# Altium schematic sheet 5V_REG.SchDoc
size B; SheetNumber: 5; SheetTotal: 17
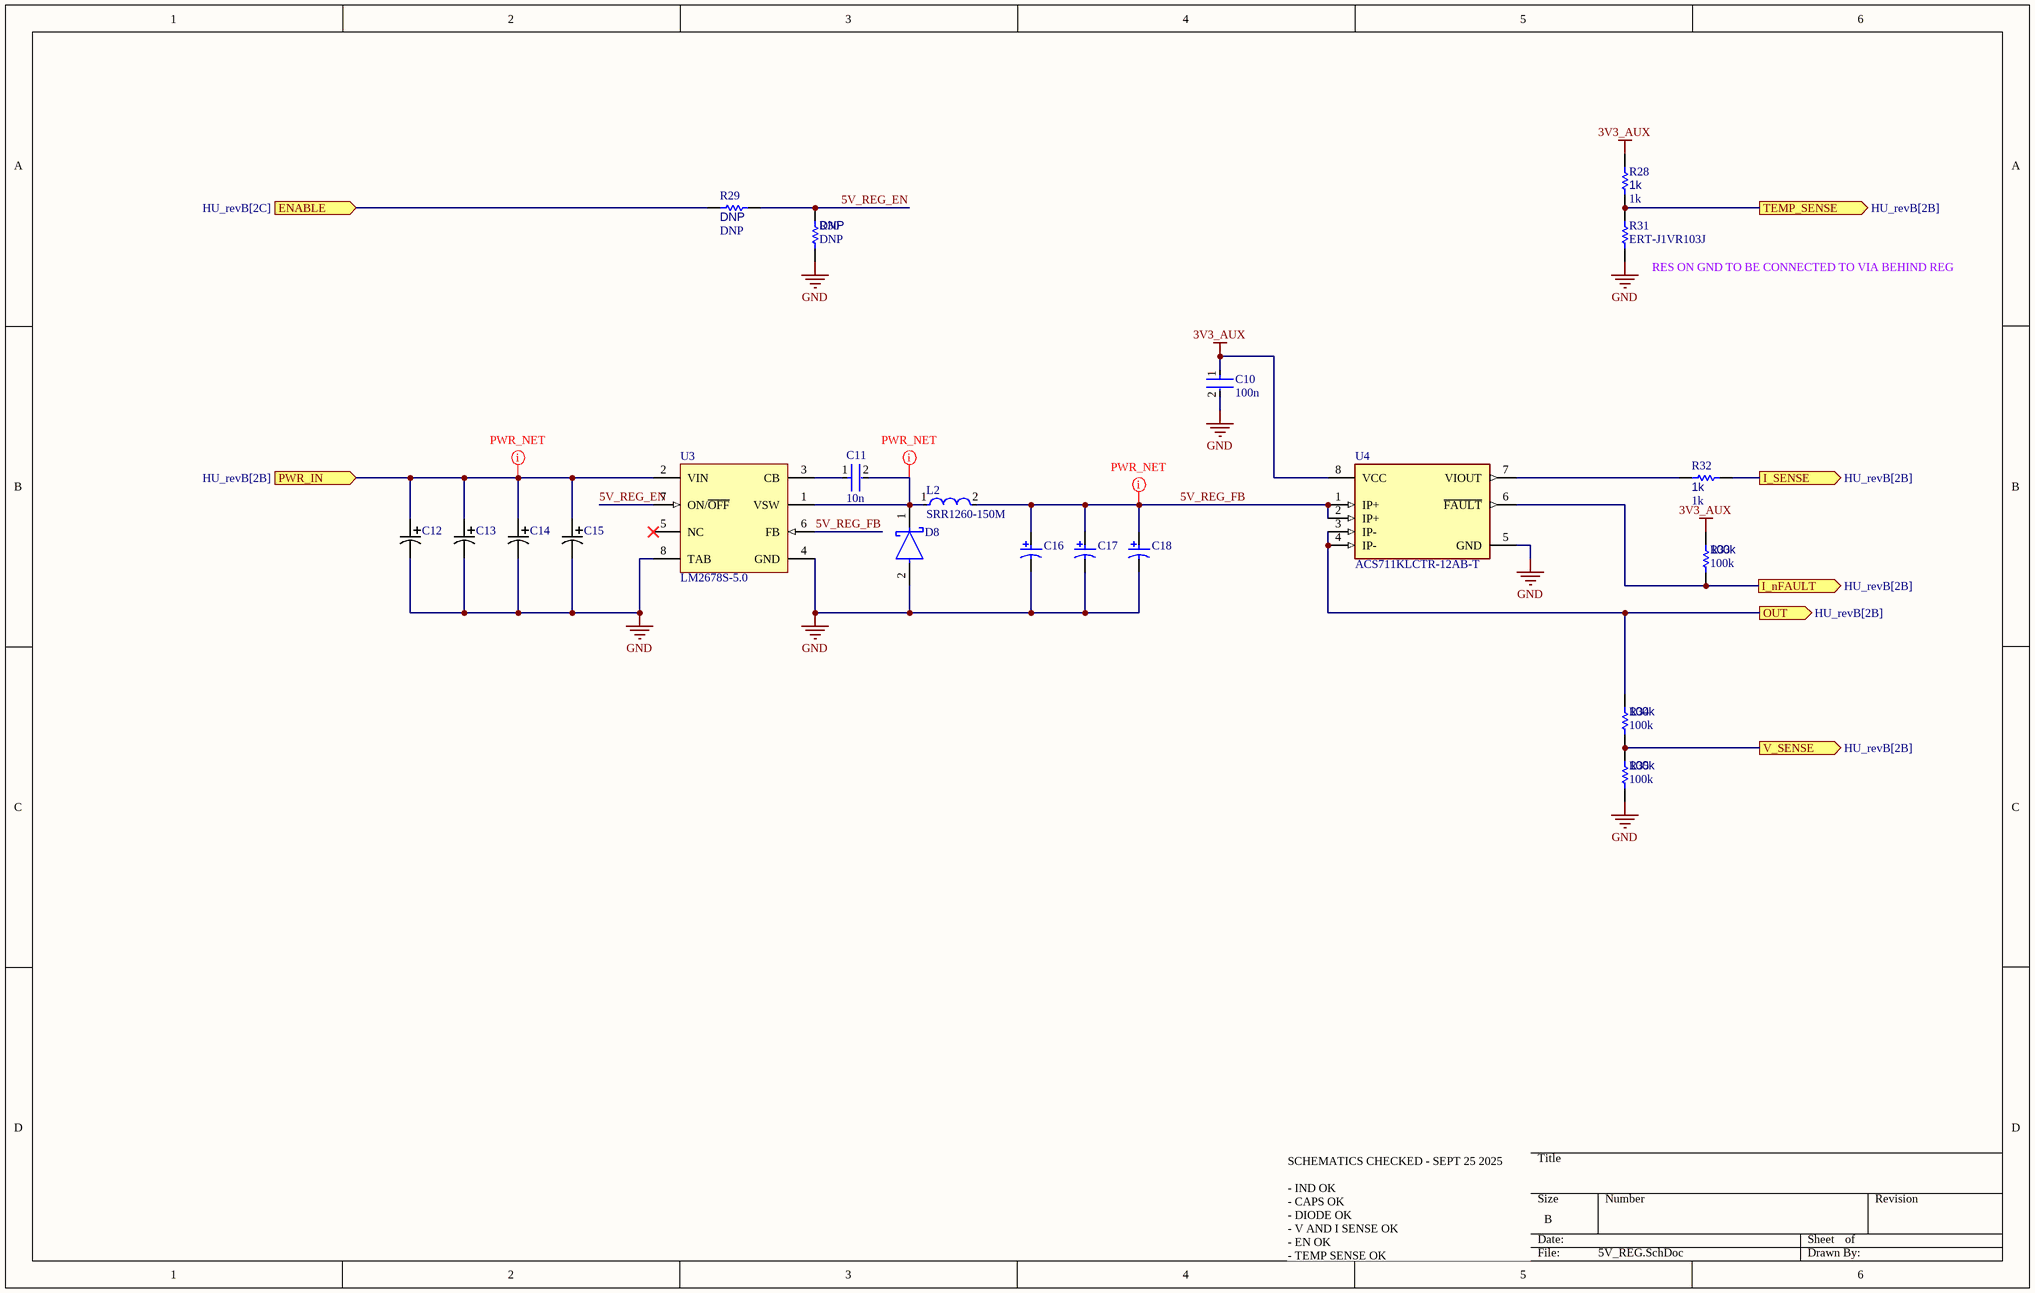
[diagram p0: 5V_REG.SchDoc]

## Parts
C10  100n  [FP-0402-L_1_0_0_05-W_0_5-IPC_A]
C11  10n  [FP-0402-L_1_0_0_05-W_0_5-IPC_A]
C12  T495D106M035ATE260  [T495D106M035ATE260-Footprint-1]  (value not drawn)
C13  T495D106M035ATE260  [T495D106M035ATE260-Footprint-1]  (value not drawn)
C14  T495D106M035ATE260  [T495D106M035ATE260-Footprint-1]  (value not drawn)
C15  T495D106M035ATE260  [T495D106M035ATE260-Footprint-1]  (value not drawn)
C16  T495D157K010ATE100  [KEMT-T495-D_L]  (value not drawn)
C17  T495D157K010ATE100  [KEMT-T495-D_L]  (value not drawn)
C18  T495D157K010ATE100  [KEMT-T495-D_L]  (value not drawn)
D8  B540C-13-F  [FP-SMC-MFG]  (value not drawn)
L2  SRR1260-150M  [FP-SRR1260-MFG]
R28  1k  [R0603B]
R29  DNP  [R0603B]
R30  DNP  [R0603B]
R31  ERT-J1VR103J  [RESC1608X90X30ML15T20]
R32  1k  [R0603B]
R33  100k  [R0603B]
R34  100k  [R0603B]
R35  100k  [R0603B]
U3  LM2678S-5.0  [KTW0007B_N]
U4  ACS711KLCTR-12AB-T  [FP-LC-8-IPC_C]

## Ports
ENABLE (in, see HU_revB[2C]), I_nFAULT (out, see HU_revB[2B]), I_SENSE (out, see HU_revB[2B]), OUT (out, see HU_revB[2B]), PWR_IN (in, see HU_revB[2B]), TEMP_SENSE (out, see HU_revB[2B]), V_SENSE (out, see HU_revB[2B])

## Nets
3V3_AUX: C10.1 R28.1 R33.2 U4.8(VCC)
GND: C10.2 C12.2 C13.2 C14.2 C15.2 C16.2 C17.2 C18.2 D8.2(A) R30.1 R31.1 R35.1 U3.4(GND) U3.8(TAB) U4.5(GND)
5V_REG_EN: R29.1 R30.2 U3.7(ON/~{OFF})
5V_REG_FB: C16.1 C17.1 C18.1 L2.2 U3.6(FB) U4.1(IP+) U4.2(IP+)
ENABLE: R29.2 ; port ENABLE
I_nFAULT: R33.1 U4.6(~{FAULT}) ; port I_nFAULT
I_SENSE: R32.1 ; port I_SENSE
OUT: R34.2 U4.3(IP-) U4.4(IP-) ; port OUT
PWR_IN: C12.1 C13.1 C14.1 C15.1 U3.2(VIN) ; port PWR_IN
TEMP_SENSE: R28.2 R31.2 ; port TEMP_SENSE
V_SENSE: R34.1 R35.2 ; port V_SENSE
NetC11_1: C11.1 U3.3(CB)
NetC11_2: C11.2 D8.1(C) L2.1 U3.1(VSW)
NetR32_2: R32.2 U4.7(VIOUT)

Not connected (* = marked no-connect by the designer): U3 5(NC)*

## Layout directives
net class PWR: 5V_REG_FB, NetC11_2, PWR_IN

## Notes on the sheet
- (near R31) RES ON GND TO BE CONNECTED TO VIA BEHIND REG
- SCHEMATICS CHECKED - SEPT 25 2025
  - IND OK
  - CAPS OK
  - DIODE OK
  - V AND I SENSE OK
  - EN OK
  - TEMP SENSE OK

## Library data of the parts
C10 C11 = CMP-001-00058-1: LARGE PADS, 0402 CAP, CHANGE COMMENT TO MATCH REAL P/N; Capacitor Type: Ceramic; Min Operating Temperature: -55°C; Mounting Technology: Surface Mount; Pins: 2; Case/Package: 0402; RoHS Compliant: Yes; Max Operating Temperature: 85°C
C12-C15 = CMP-001-00065-3: Tantalum Capacitor, Polarized, Tantalum (dry/solid), 35V, 20% +Tol, 20% -Tol, 10uF, Surface Mount, 2917; Value: 10µF; Case/Package: Molded; Mounting Technology: Surface Mount; Max Operating Temperature: 125°C; Tolerance: 20%; Min Operating Temperature: -55°C
C16-C18 = CMP-2000-07208-1: Capacitor, Tantalum, 150 uF, +/- 10%, 10 V, -55 to 125 degC, 2-Pin SMD, RoHS, Tape and Reel; Manufacturer: Kemet; Capacitance: 150µF; ESR: 0.1ohm; Voltage Rating: 10V; Capacitor Case Style: 2917; Package Description: 2-Pin Surface Mount Device, Body 7.3 x 4.3 mm; MSL: MSL1-Unlimited; Package Reference: T495-D; Mounting Technology: SurfaceMount; Datasheet URL: http://capacitoredge.kemet.com/capedge2/DataSheet/Datasheet-T495D157K010ATE100.pdf?pn=T495D157K010ATE100; Datasheet Version: 09/2016; Capacitance Tolerance: ±10%; Capacitor Terminals: SMD; Operating Temperature Range: -55°Cto+125°C; Manufacturer URL: http://www.kemet.com/
D8 = CMP-2000-05097-3: DIODE SCHOTTKY 40V 5A SMC; Manufacturer: Diodes Inc.; Automotive Grade: NA; Peak Reverse Current: 0.5mA; Value: 300pF; Max Junction Temp: +150°C; Max Surge Forward Current: 100A; Standoff Height: 0.1mm; Digikey Description: DIODE SCHOTTKY 40V 5A SMC; Temperature Range Low: -55°C; Manufacturer Part Number: B540C-13-F; Octopart: https://octopart.com/b540c-13-f-diodes+inc.-325873; Lead Free: Yes; Reverse Voltage: 40V; RoHS: TRUE; Category: Diode; Mouser Description: Diode: Schottky rectifying; SMD; 40V; 5A; SMC; Package: reel, tape; ComponentLink2Description: Datasheet; Temperature Range High: +150°C; Automotive: No; Footprint Url: https://www.diodes.com/assets/Package-Files/SMC.pdf; Device Class L3: Schottky Diodes; Height: 2.5mm; Forward Current: 5A; Temperature: -55°C to +150°C; Package: SMC; ComponentLink2URL: https://www.diodes.com/assets/Datasheets/ds13012.pdf; Device Class L2: Diodes; Max Repetitive Reverse Voltage: 40V; Device Class L1: Discrete Semiconductors; Capacitance: 300pF
L2 = CMP-2000-07146-2: FIXED IND 15UH 5A 27 MOHM SMD; Q Factor: 25; Sample Rate (Hz): 100kHz; Resistance: 27MR; Material: Steel; Inductance Tolerance: 20%; Frequency: 17.6MHz; Saturation Current: 4.6A; Core Material: Ferrite; Shielding: Shielded; Series: SRR1260; Termination: SMD/SMT; Packaging: Tape and Reel; RoHS Compliant: Yes; Height - Seated (Max): 0.256inch; Depth: 12.8mm; Case/Package: 1260; Inductance: 15uH; Height: 6mm; Number of Pins: 2; Mount: Surface Mount; Min Operating Temperature: -40°C; Test Frequency: 100kHz; Length: 12.5mm; Self Resonant Frequency: 17.6MHz; Current Rating: 5A; Tolerance: 20%; RMS Current (Irms): 5A; REACH SVHC: No SVHC; Resistor Type: Wirewound; DC Resistance (DCR): 27mR; Width: 12.5mm; Package Quantity: 600; DC Current: 5A; Max DC Current: 5A; Max Operating Temperature: 125°C; Military Standard: Not
R28-R30 R32-R35 = CMP-009-00002-14: Resistor
  R28 R32: Value: 1k
  R29 R30: Value: DNP
  R33-R35: Value: 100k
R31 = CMP-2000-00869-1: Manufacturer: Panasonic; Part Number: ERT-J1VR103J
U3 = CMP-0069-00190-3: SIMPLE SWITCHER® High Efficiency 5A Step-Down Voltage Regulator, 7-pin TO-263; Manufacturer: Texas Instruments; PowerWise: N; PackageTopMarking: NSUZXYTTE#*LM2678*S-5.0; RoHS: N; PinCount: 7; Code_JEDEC: MO-169-AC; ComponentLink1URL: http://www.ti.com/general/docs/lit/getliterature.tsp?genericPartNumber=LM2678&fileType=pdf; ComponentLink1Description: Datasheet URL; PackageReference: KTW0007B; PackageDescription: TO-263, Molded, .400 x .390 x .180in Body, 7 Lead, .050in Pitch, Surface Mount; CompType: Switcher
U4 = CMP-1557-00012-2: SENSOR CURRENT HALL 12.5A AC/DC; Number of Channels: 1; Min Supply Voltage: 3V; Sensitivity: 110mV/A; Response Time: 4.6us; Operating Supply Voltage: 3.3V; Max Supply Voltage: 5.5V; Max Supply Current: 5.5mA; Bandwidth: 100kHz; Linearity: 1%; Quiescent Current: 4mA; Accuracy: 5%; Polarity: Bidirectional; Case/Package: SOIC; Packaging: Tape and Reel; Number of Pins: 8; Width: 3.9mm; Frequency: 100kHz; -3db Bandwidth: 100kHz; REACH SVHC: No SVHC; Series: -; Height: 1.5mm; Package Quantity: 1; Min Operating Temperature: -40°C; Max Operating Temperature: 125°C; Current Sensing: 12.5A; RoHS Compliant: Yes; Length: 4.9mm